# Altium schematic sheet TEMP.SchDoc
size A3; SheetNumber: 15; SheetTotal: 23
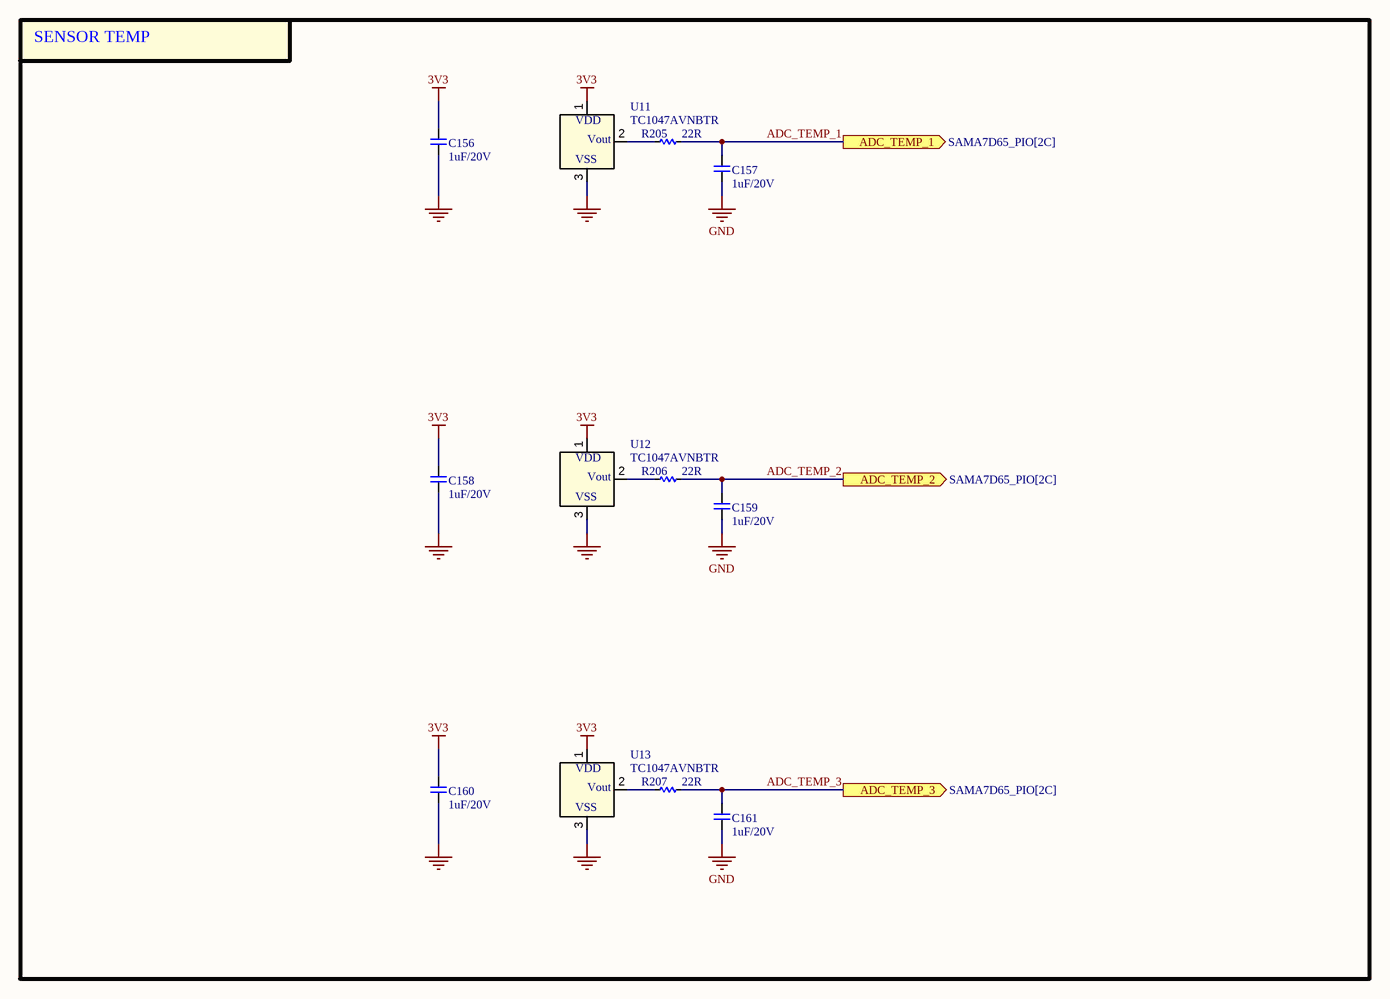
[diagram p0: TEMP.SchDoc]

## Parts
C156  1uF/20V  [CAP_C_1005X50_L]
C157  1uF/20V  [CAP_C_1005X50_L]
C158  1uF/20V  [CAP_C_1005X50_L]
C159  1uF/20V  [CAP_C_1005X50_L]
C160  1uF/20V  [CAP_C_1005X50_L]
C161  1uF/20V  [CAP_C_1005X50_L]
R205  22R  [RES_C_1005x30_L]
R206  22R  [RES_C_1005x30_L]
R207  22R  [RES_C_1005x30_L]
U11  TC1047AVNBTR  [SOT-23_MC_MCH]
U12  TC1047AVNBTR  [SOT-23_MC_MCH]
U13  TC1047AVNBTR  [SOT-23_MC_MCH]

## Blocks framed on the sheet
SENSOR TEMP: C156-C161 R205-R207 U11-U13

## Ports
ADC_TEMP_1 (out, see SAMA7D65_PIO[2C]), ADC_TEMP_2 (out, see SAMA7D65_PIO[2C]), ADC_TEMP_3 (out, see SAMA7D65_PIO[2C])

## Nets
3V3: C156.2 C158.2 C160.2 U11.1(VDD) U12.1(VDD) U13.1(VDD)
GND: C156.1 C157.1 C158.1 C159.1 C160.1 C161.1 U11.3(VSS) U12.3(VSS) U13.3(VSS)
ADC_TEMP_1: C157.2 R205.2 ; port ADC_TEMP_1
ADC_TEMP_2: C159.2 R206.2 ; port ADC_TEMP_2
ADC_TEMP_3: C161.2 R207.2 ; port ADC_TEMP_3
NetR205_1: R205.1 U11.2(VOUT)
NetR206_1: R206.1 U12.2(VOUT)
NetR207_1: R207.1 U13.2(VOUT)

## Notes on the sheet
- Project:
- Page Contents:
- Revision:
- Design:
- Date:
- Size:
- A3
- Document Number:
- Sheet:
- of
- (in symbol TC1047AVNBTR) Vout

## Library data of the parts
C156-C161 = _CAP_C_2: CAP CHIP
R205-R207 = _RES_B_2: RES
U11-U13 = TC1047AVNBTR: SENSOR ANALOG -40C-125C SOT23-3; Manufacturer_Name: Microchip; Copyright: Copyright (C) 2025 Ultra Librarian. All rights reserved.; Manufacturer_Part_Number: TC1047AVNBTR; RefDes: RefDes; Type: Type